# EAGLE design dc_sensor_v2 (EAGLE 6.2)
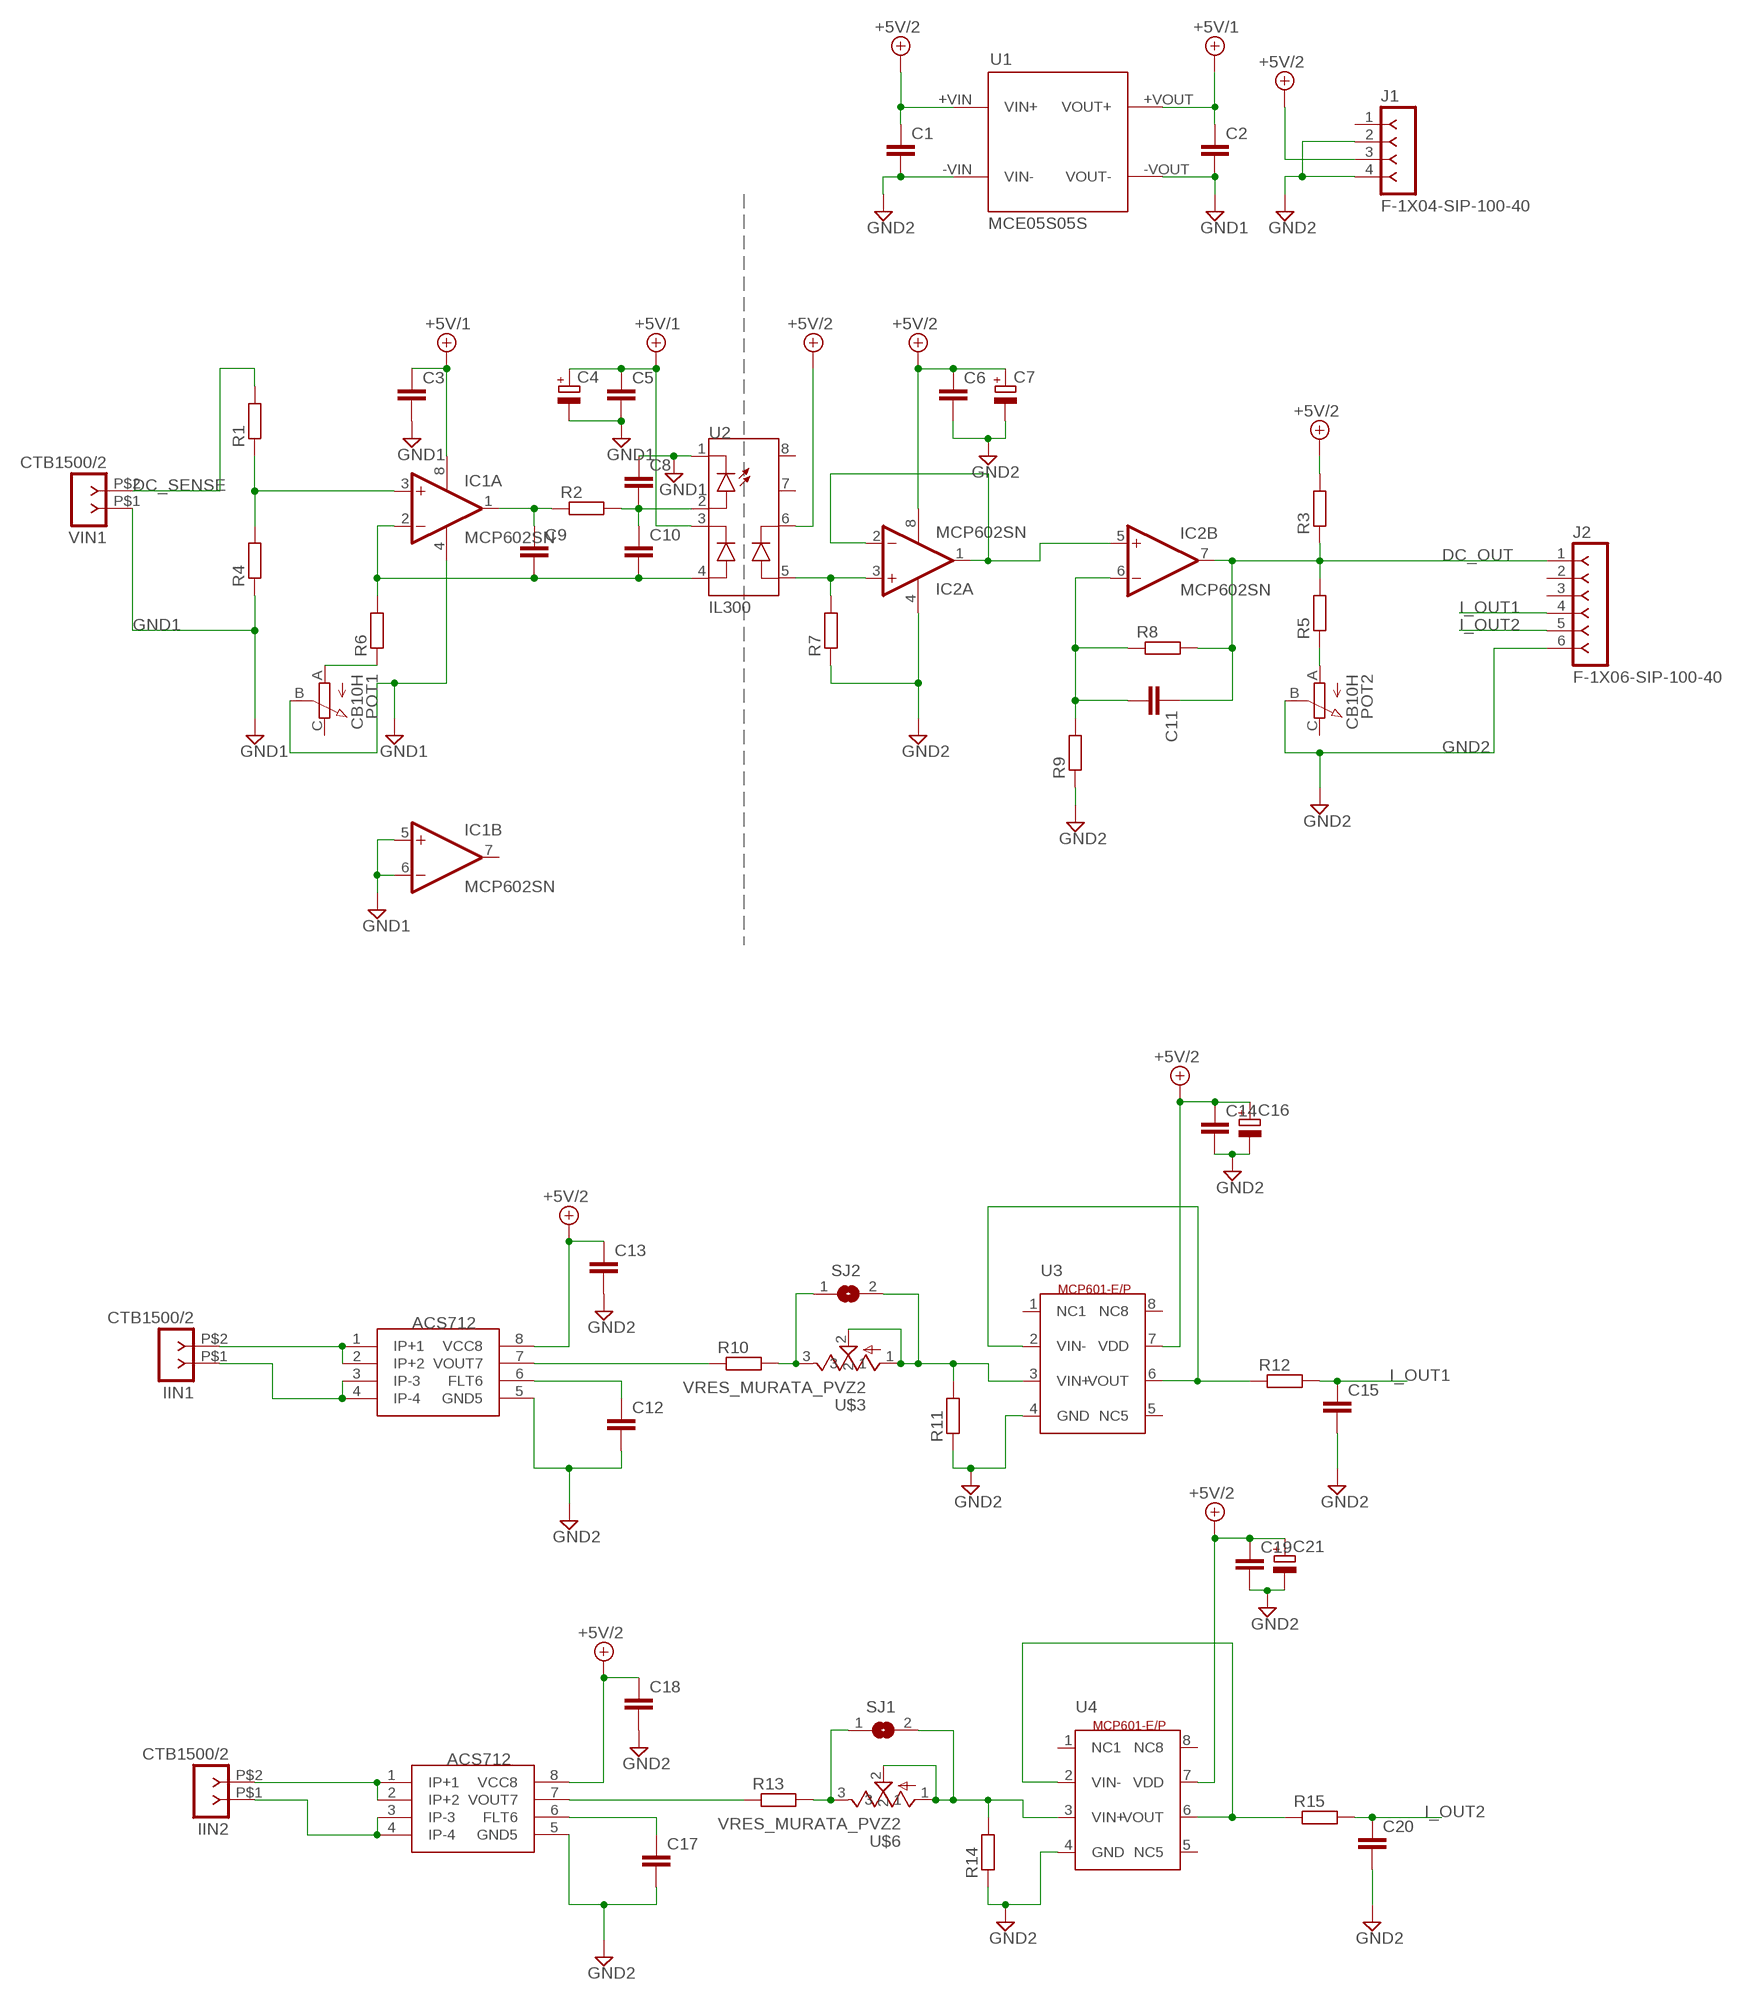
[diagram p0: schematic, sheet 1]

## Parts
C1  C-EUC1206  [C1206]
C2  C-EUC1206  [C1206]
C3  C-EU025-040X050  [C025-040X050]
C4  CPOL-EUE2-5  [E2-5]
C5  C-EU025-040X050  [C025-040X050]
C6  C-EU025-040X050  [C025-040X050]
C7  CPOL-EUE2-5  [E2-5]
C8  C-EU025-040X050  [C025-040X050]
C9  C-EU025-040X050  [C025-040X050]
C10  C-EU025-040X050  [C025-040X050]
C11  C-EU025-040X050  [C025-040X050]
C12  C-EU025-030X050  [C025-030X050]
C13  C-EUC0603  [C0603]
C14  C-EUC0603  [C0603]
C15  C-EU025-030X050  [C025-030X050]
C16  CPOL-EUE2.5-6  [E2,5-6]
C17  C-EU025-030X050  [C025-030X050]
C18  C-EUC0603  [C0603]
C19  C-EUC0603  [C0603]
C20  C-EU025-030X050  [C025-030X050]
C21  CPOL-EUE2.5-6  [E2,5-6]
IC1  MCP602SN  [SO08]
IC2  MCP602SN  [SO08]
IIN1  CTB1500/2  [CTB1500-2]
IIN2  CTB1500/2  [CTB1500-2]
J1  F-1X04-SIP-100-40  [SIP-100-04-40]
J2  F-1X06-SIP-100-40  [SIP-100-06-40]
POT1  CB10H  [CB10V]
POT2  CB10H  [CB10V]
R1  R-EU_0207/10  [0207/10]
R2  R-EU_0207/10  [0207/10]
R3  R-EU_0207/10  [0207/10]
R4  R-EU_0207/10  [0207/10]
R5  R-EU_0207/10  [0207/10]
R6  R-EU_0207/10  [0207/10]
R7  R-EU_0207/10  [0207/10]
R8  R-EU_0207/10  [0207/10]
R9  R-EU_0207/10  [0207/10]
R10  R-EU_0207/10  [0207/10]
R11  R-EU_0207/10  [0207/10]
R12  R-EU_0207/10  [0207/10]
R13  R-EU_0207/10  [0207/10]
R14  R-EU_0207/10  [0207/10]
R15  R-EU_0207/10  [0207/10]
SJ1  SJ  [SJ]
SJ2  SJ  [SJ]
U1  MCE05S05S  [MCEXXSXXS_SIP]
U2  IL300  [DIL08]
U3  MCP601  [SO8]
U4  MCP601  [SO8]
U5  ACS712  [SO8]
U6  ACS712  [SO8]
U$3  VRES_MURATA_PVZ2  [MURATA_PVZ2A]
U$6  VRES_MURATA_PVZ2  [MURATA_PVZ2A]
VIN1  CTB1500/2  [CTB1500-2]

## Nets
+5V/1: C2.1 C3.1 C4.+ C5.1 IC1.8(P:V+) U1.+VOUT(VOUT+) U2.3(C_FB)
+5V/2: C1.1 C6.1 C7.+ C13.1 C14.1 C16.+ C18.1 C19.1 C21.+ IC2.8(P:V+) J1.3 R3.2 U1.+VIN(VIN+) U2.6(C_OUT) U3.7(VDD) U4.7(VDD) U5.8(VCC8) U6.8(VCC8)
DC_OUT: C11.1 IC2.7(B:OUT) J2.1 R3.1 R5.2 R8.2
DC_SENSE: R1.2 VIN1.P$2
GND1: C2.2 C3.2 C4.- C5.2 C8.1 IC1.4(P:V-) IC1.5(B:+IN) IC1.6(B:-IN) POT1.B(S) R4.1 U1.-VOUT(VOUT-) U2.1(C_LED) VIN1.P$1
GND2: C1.2 C6.2 C7.- C12.2 C13.2 C14.2 C15.2 C16.- C17.2 C18.2 C19.2 C20.2 C21.- IC2.4(P:V-) J1.2 J1.4 J2.6 POT2.B(S) R7.1 R9.1 R11.1 R14.1 U1.-VIN(VIN-) U3.4(GND) U4.4(GND) U5.5(GND5) U6.5(GND5)
I_OUT1: C15.1 J2.4 R12.2
I_OUT2: C20.1 J2.5 R15.2
N$1: C9.2 C10.2 IC1.2(A:-IN) R6.2 U2.4(A_FB)
N$2: POT2.A R5.1
N$3: IC2.3(A:+IN) R7.2 U2.5(A_OUT)
N$4: C8.2 C10.1 R2.2 U2.2(A_LED)
N$5: C9.1 IC1.1(A:OUT) R2.1
N$6: IC2.1(A:OUT) IC2.2(A:-IN) IC2.5(B:+IN)
N$7: POT1.A R6.1
N$8: IC1.3(A:+IN) R1.1 R4.2
N$9: IIN1.P$2 U6.1(IP+1) U6.2(IP+2)
N$10: C11.2 IC2.6(B:-IN) R8.1 R9.2
N$11: IIN1.P$1 U6.3(IP-3) U6.4(IP-4)
N$12: R10.2 SJ2.1 U$3.3
N$13: C12.1 U6.6(FLT6)
N$14: R12.1 U3.2(VIN-) U3.6(VOUT)
N$15: IIN2.P$2 U5.1(IP+1) U5.2(IP+2)
N$16: R10.1 U6.7(VOUT7)
N$17: R11.2 SJ2.2 U3.3(VIN+) U$3.1 U$3.2
N$18: IIN2.P$1 U5.3(IP-3) U5.4(IP-4)
N$19: C17.1 U5.6(FLT6)
N$20: R13.1 U5.7(VOUT7)
N$21: R14.2 SJ1.2 U4.3(VIN+) U$6.1 U$6.2
N$22: R13.2 SJ1.1 U$6.3
N$23: R15.1 U4.2(VIN-) U4.6(VOUT)
Unconnected: IC1.7(B:OUT) J1.1 J2.2 J2.3 POT1.C(E) POT2.C(E) U2.7(PIN7) U2.8(PIN8) U3.1(NC1) U3.5(NC5) U3.8(NC8) U4.1(NC1) U4.5(NC5) U4.8(NC8)

## Library data of the parts
C1-C3 C5 C6 C8-C15 C17-C20 = resistor:C-EU: CAPACITOR, European symbol
C4 C7 C16 C21 = resistor:CPOL-EU: POLARIZED CAPACITOR, European symbol
IC1 IC2 = linear:MCP602: Single Op Amp 2.7V to 6.0V Single Supply CMOS Source: http://ww1.microchip.com/downloads/en/DeviceDoc/21314g.pdf
IIN1 IIN2 VIN1 = eko-parts:CTB1500/2
J1 = con-headers-jp:F-1X04-: FEMALE HEADER
J2 = con-headers-jp:F-1X06-: FEMALE HEADER
POT1 POT2 = passive-trimmer:CB10H: http://onecall.farnell.com/jsp/search/browse.jsp;jsessionid=SRTOMW5W3RDHYCQLCIQZOXQ?N=411&Ntk=gensearch&Ntt=CB10*V&Ntx=mode+matchallpartial&exposeLevel2Refinement=true&suggestions=false&ref=globalsearch&_requestid=163591 http://www.tycoelectronics.com/commerce/DocumentDelivery/DDEController?Action=srchrtrv&DocNm=1773190&DocType=Data+Sheet&DocLang=English
R1-R15 = resistor:R-EU_: RESISTOR, European symbol
SJ1 SJ2 = jumper:SJ: SMD solder JUMPER
U1 = modules:MCE05S05S
U2 = ic-optoisolator:IL300
U3 U4 = eko-parts:MCP601
U5 U6 = eko-parts:ACS712
U$3 U$6 = eko-parts:VRES_MURATA_PVZ2: http://www.farnell.com/datasheets/477473.pdf http://onecall.farnell.com/jsp/search/browse.jsp?N=411+202462+110264549+732+502&Ns=P_PRICE_ONECALL_UK|0&locale=en_GB&appliedparametrics=true&getResults=true&suppressRedirect=true&originalQueryURL=/jsp/search/browse.jsp%3FN%3D411%2B202462%26No%3D0%26getResults%3Dtrue%26appliedparametrics%3Dtrue%26locale%3Den_GB%26divisionLocale%3Den_GB%26catalogId%3D%26prevNValues%3D411%2B202462

## Board
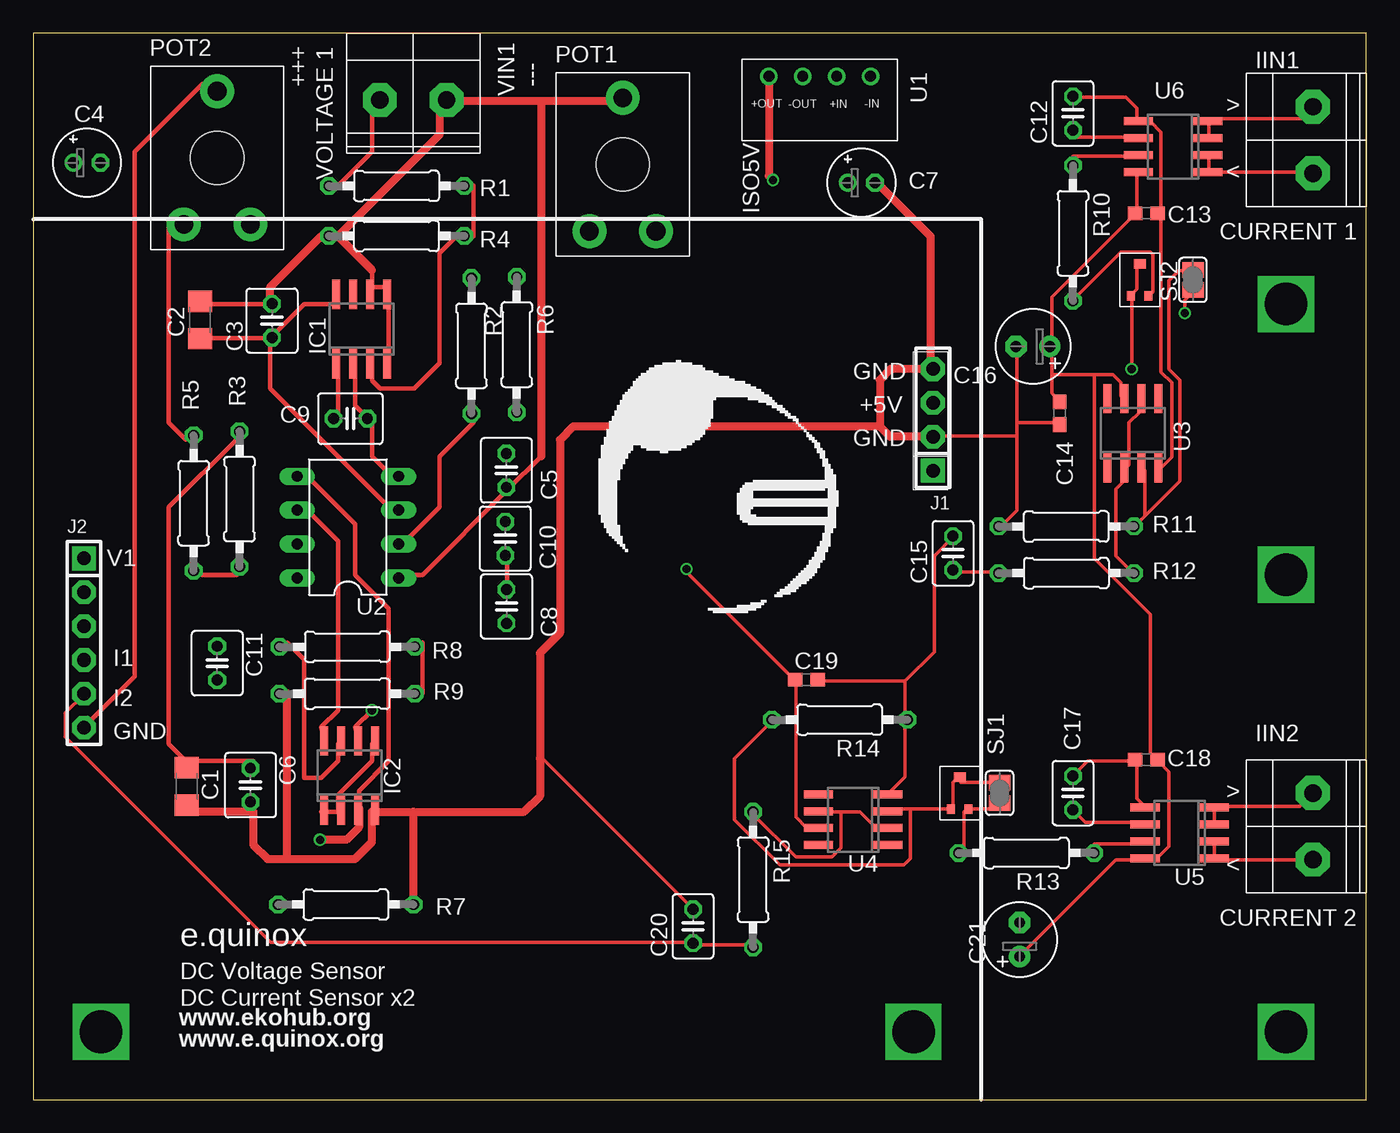
[diagram p1: board, top side]
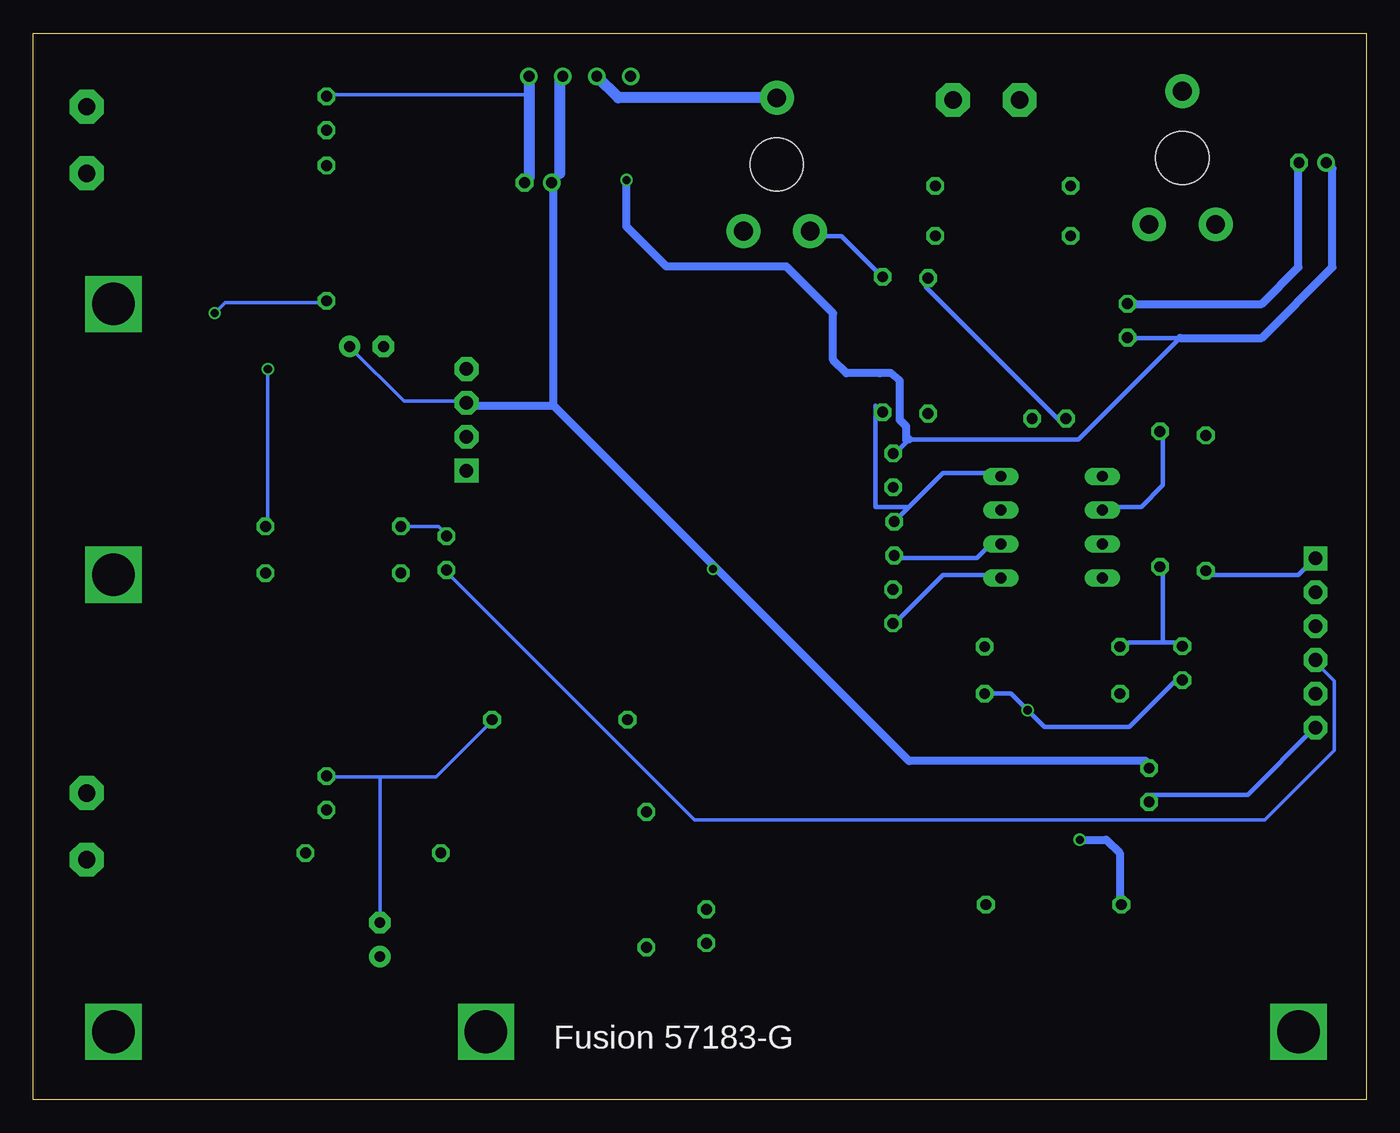
[diagram p2: board, bottom side, seen from below]

Size 100 x 80 mm. Coordinates in mm from the lower left corner, seen from the top.
Outline: 0,0 100,0 100,80 0,80 0,0
Copper layers (1*16): Top 0.035mm / dielectric 1.5mm / Bottom 0.035mm
Design rules: minimum track width 6mil, minimum drill 12mil, track to track 6mil, track to pad 6mil, pad to pad 6mil, via to via 6mil, smd to smd 0mil, copper to edge 10mil, drill to drill 10mil, minimum pad ring 10mil, minimum via ring 6mil, stop-mask expansion 2mil, vias tented up to drill 100mil, thermal gap 10mil

### Footprints (pad centres in the part's own frame; a part is rotated, then mirrored left to right if it is on the bottom)
C1206 = smd 1.6 x 1.8: 1 -1.4,0; 2 1.4,0
C025-040X050 = drill 0.813 octagon: 1 -1.27,0; 2 1.27,0
E2-5 = drill 0.813 pad 1.27: + -1.016,0 | drill 0.813 pad 1.27 octagon: - 1.016,0
C025-030X050 = drill 0.813 octagon: 1 -1.27,0; 2 1.27,0
C0603 = smd 1.1 x 1: 1 -0.85,0; 2 0.85,0
E2,5-6 = drill 0.813 pad 1.6: + -1.27,0 | drill 0.813 pad 1.6 octagon: - 1.27,0
SO08 = smd 0.6 x 2.2: 1 -1.905,-2.6; 2 -0.635,-2.6; 3 0.635,-2.6; 4 1.905,-2.6; 5 1.905,2.6; 6 0.635,2.6; 7 -0.635,2.6; 8 -1.905,2.6
CTB1500-2 = drill 1.3 pad 2.54 octagon: P$1 -2.5,0.5; P$2 2.5,0.5
SIP-100-04-40 = drill 1.016 pad 1.778 square: 1 -3.81,0 | drill 1.016 pad 1.778 octagon: 2 -1.27,0; 3 1.27,0; 4 3.81,0
SIP-100-06-40 = drill 1.016 pad 1.778 square: 1 -6.35,0 | drill 1.016 pad 1.778 octagon: 2 -3.81,0; 3 -1.27,0; 4 1.27,0; 5 3.81,0; 6 6.35,0
CB10V = drill 1.4 pad 2.54: A -2.5,-5; B 0,5; C 2.5,-5 | hole 4: 0,0
0207/10 = drill 0.813 octagon: 1 -5.08,0; 2 5.08,0
SJ = smd 1.168 x 1.6: 1 -0.762,0; 2 0.762,0
MCEXXSXXS_SIP = drill 0.8: +VIN -1.27,-1.778; +VOUT 3.81,-1.778; -VIN -3.81,-1.778; -VOUT 1.27,-1.778
DIL08 = drill 0.813 long: 1 -3.81,-3.81; 2 -1.27,-3.81; 3 1.27,-3.81; 4 3.81,-3.81; 5 3.81,3.81; 6 1.27,3.81; 7 -1.27,3.81; 8 -3.81,3.81
SO8 = smd 0.6 x 2.2: 1 -1.905,-2.6; 2 -0.635,-2.6; 3 0.635,-2.6; 4 1.905,-2.6; 5 1.905,2.6; 6 0.635,2.6; 7 -0.635,2.6; 8 -1.905,2.6
MURATA_PVZ2A = smd 0.6 x 0.7: 1 -0.65,-1.2; 3 0.65,-1.2 | smd 0.9 x 0.7: 2 0,1.2

### Placement (x,y rotation side)
C1  11.5,23.5 270 top
C2  12.5,58.5 90 top
C3  17.91,58.44 90 top
C4  4.02,70.29 0 top
C5  35.49,47.21 270 top
C6  16.29,23.59 270 top
C7  62.13,68.79 0 top
C8  35.5,37 90 top
C9  23.79,51.09 0 top
C10  35.41,42.09 90 top
C11  13.79,32.74 270 top
C12  78,74 90 top
C13  83.5,66.5 0 top
C14  77,51.5 270 top
C15  69,41 90 top
C16  75,56.5 180 top
C17  78,23 90 top
C18  83.5,25.5 180 top
C19  58,31.5 0 top
C20  49.5,13 90 top
C21  74,12 90 top
IC1  24.63,57.81 0 top
IC2  23.74,24.31 0 top
IIN1  95.5,72 270 top
IIN2  95.5,20.5 270 top
J1  67.5,51 90 top
J2  3.8,34.25 270 top
POT1  44.22,70.16 0 top
POT2  13.79,70.66 0 top
R1  27.25,68.55 180 top
R2  32.87,56.55 270 top
R3  15.47,45.05 90 top
R4  27.25,64.8 0 top
R5  12.03,44.75 270 top
R6  36.27,56.65 270 top
R7  23.45,14.63 180 top
R8  23.55,33.97 180 top
R9  23.55,30.45 0 top
R10  78,65 270 top
R11  77.5,43 0 top
R12  77.5,39.5 180 top
R13  74.5,18.5 180 top
R14  60.5,28.5 180 top
R15  54,16.5 270 top
SJ1  72.5,23 90 top
SJ2  87,61.5 90 top
U1  59,75 180 top
U2  23.6,42.95 90 top
U3  82.5,50 0 top
U4  61.5,21 90 top
U5  86,20 90 top
U6  85.5,71.5 90 top
U$1  [EQNXLOGO]  52.5,45 0 top
U$3  83,61.5 0 top
U$6  69.5,23 0 top
VIN1  28.5,75.5 180 top

### Tracks (layer width: path | path; a pad name or v marks a point on that pad's centre or on a via)
+5V/1  (via drill 0.6)
  Top 0.33: 17.78,57.15 12.7,57.15 C2.1 | 17.78,57.15 20.32,59.69 22.86,59.69 IC1.8 | 17.78,57.15 17.78,53.34 26.67,44.45 U2.3 | 17.78,57.15 C3.1
  Top 0.61: U1.+VOUT 55.19,69.31 v55.5,69
  Bottom 0.33: 2.54,69.85 C4.+ | C3.1 17.78,57.15 13.97,57.15 21.59,49.53 34.29,49.53 35.56,48.26 C5.1
  Bottom 0.61: 13.97,57.15 7.83,57.15 2.54,62.44 2.54,69.85 | 34.29,49.53 34.5,49.5 34.5,50.5 35,51 35,53.94 35.64,54.49 36.5,54.5 39,54.5 40,55.5 40,59 43.5,62.5 52.5,62.5 55.5,65.5 v55.5,69
+5V/2  (via drill 0.61)
  Top 0.254: C21.+ 74,10.8 81.2,18 83.4,18 U5.8 83.4,18.2 84.4,18.2 85.2,19 85.2,24.6 84.4,25.4 C18.1 84.2,25.6 83.8,26 83.8,36.4 79.6,40.6 79.6,54.4 | U6.8 82.8,69.4 82.8,66.6 C13.1 82.6,66.4 76.4,60.2 76.4,56.6 C16.+ 76.4,56.4 76.4,54.4 | 76.4,54.4 76.4,53 77,52.4 C14.1 | 76.4,54.4 79.6,54.4 | 79.6,54.4 81,54.4 81.6,53.8 81.6,52.8 81.8,52.6 U3.7 | U4.7 58.8,20.4 58,20.4 57.2,21.2 57.2,31.4 C19.1 57,31.6 49,39.6 v49,39.8
  Top 0.33: 11.43,25.4 16.51,25.4 C6.1 | IC2.8 21.59,27.94 22.86,29.21 22.86,41.91 20.32,44.45 U2.6 | 11.43,25.4 10.16,26.67 10.16,44.45 15.24,49.53 R3.2 | 11.43,25.4 C1.1
  Bottom 0.254: v49,39.8 48.84,39.95 | C16.+ 76.2,56.4 72.2,52.4 67.8,52.4 J1.3
  Bottom 0.33: 60.96,68.58 C7.+ | R3.2 15.24,49.53 15.24,46.09 16.88,44.45 19.05,44.45 U2.6 | 16.51,25.4 C6.1
  Bottom 0.61: 60.96,52.07 60.96,68.58 | 60.96,52.07 67.31,52.07 J1.3 | 60.96,52.07 48.84,39.95 34.29,25.4 16.51,25.4 | 61.11,68.89 60.5,69.5
  Bottom 0.813: C7.+ 61.11,68.89 | 60.5,69.5 60.5,76.55 U1.+VIN
DC_OUT
  Top 0.33: R5.2 12.7,39.37 15.24,39.37 R3.1 | IC2.7 22.86,26.67 22.86,25.4 21.59,24.13 20.32,24.13 20.32,33.02 19.05,34.29 R8.2
  Bottom 0.33: J2.1 3.81,40.64 5.08,39.37 11.43,39.37 R5.2 | 15.24,34.29 17.78,34.29 R8.2 | 15.24,34.29 13.97,34.29 C11.1 | 15.24,34.29 15.24,39.37 R3.1
DC_SENSE
  Top 0.33: R1.2 22.86,68.58 25.4,71.12 25.4,74.93 VIN1.P$2
GND1
  Top 0.33: IC1.4 26.67,55.88 26.67,59.69 IC1.5 26.67,60.96 25.4,60.96 | 25.4,60.96 25.4,62.23 | 25.4,60.96 IC1.6 | C2.2 12.7,59.69 17.78,59.69 C3.2 | 21.59,64.77 R4.1 | 35.56,45.72 29.21,39.37 27.94,39.37 U2.1 | 38.1,48.26 35.56,45.72 | 35.56,45.72 C5.2
  Top 0.61: 25.4,62.23 22.86,64.77 | 21.59,64.77 17.78,60.96 17.78,59.69 | 38.1,74.93 31.75,74.93 VIN1.P$1 30.48,74.93 30.48,72.39 22.86,64.77 | 38.1,74.93 43.18,74.93 POT1.B | 38.1,74.93 38.1,48.26 | 22.86,64.77 R4.1
  Bottom 0.33: 5.08,69.85 C4.- | 17.78,59.69 C3.2 | C8.1 35.56,35.56 31.75,39.37 27.94,39.37 U2.1
  Bottom 0.61: 17.78,59.69 7.83,59.69 5.08,62.44 5.08,69.85
  Bottom 0.813: POT1.B 56.11,75.16 U1.-VOUT
GND2
  Top 0.254: 65.4,31.4 59,31.4 C19.2 | 65.4,31.4 65.4,28.6 R14.1 65.4,28.4 65.4,24.2 64.2,23 U4.4 | C17.2 79.13,25.4 82.6,25.4 C18.2 82.8,25.4 82.8,22.6 83.4,22 U5.5 | 84.6,66.8 84.4,66.6 C13.2 84.6,66.8 | 84.6,66.8 84.6,72.6 83.8,73.4 83,73.4 U6.5 82.8,73.6 82.8,74.38 81.97,75.2 78,75.2 C12.2 | 84.6,66.8 84.6,54.6 85.4,53.8 85.4,48.2 84.6,47.4 U3.4 | C20.2 49.4,14.4 38.2,25.6 38,25.6 | 73.8,50.8 77,50.8 C14.2 | 73.8,50.8 73.8,56.4 C16.- | 73.8,50.8 73.8,49.8 | 73.8,49.8 73.8,44.2 72.6,43 R11.1 | 73.8,49.8 67.8,49.8 J1.2 | 65.4,31.4 67.6,33.6 67.6,40.8 69,42.2 C15.2
  Top 0.33: 11.43,21.59 C1.2 | 19.05,30.48 R9.1 | POT2.B 12.7,76.2 7.62,71.12 7.62,31.75 3.81,27.94 J2.6 | 25.4,21.59 IC2.4
  Top 0.61: C7.- 63.5,68.58 67.31,64.77 67.31,55 J1.4 64.31,54.81 63.5,54 63.5,50.5 | 16.51,21.59 11.43,21.59 | 16.51,21.59 16.51,19.12 17.58,18.05 19.05,18.05 | 19.05,18.05 24.13,18.05 25.4,19.32 25.4,21.59 28.5,21.59 | 16.51,21.59 C6.2 | 19.05,18.05 19.05,30.48 | 28.5,21.59 36.83,21.59 38,22.76 38,25.6 38,33.5 39.5,35 39.5,49.5 40.5,50.5 63.5,50.5 | J1.2 64.27,49.73 63.5,50.5 | R7.1 28.53,21.56 28.5,21.59
  Bottom 0.254: 74,24.2 C21.- | 74,24.2 78,24.2 C17.2 | 74,24.2 69.8,24.2 65.6,28.4 R14.1 | R11.1 69.6,43 69,42.4 C15.2 | 62.81,75.4 78,75.4 C12.2
  Bottom 0.33: J2.6 3.81,27.94 8.89,22.86 16.51,22.86 C6.2
  Bottom 0.61: 62.81,69.13 C7.-
  Bottom 0.813: U1.-VIN 62.81,75.4 62.81,69.13
I_OUT1
  Top 0.254: C15.1 69,39.6 72.4,39.6 R12.2
  Bottom 0.254: J2.4 3.8,32.8 2.4,31.4 2.4,26.2 7.6,21 50.4,21 69,39.6 C15.1
I_OUT2
  Top 0.254: R15.2 54,11.6 49.6,11.6 C20.1 49.4,11.8 17.8,11.8 2.4,27.2 2.4,29 3.8,30.4 J2.5
N$1
  Top 0.33: 25.4,50.8 24.13,52.07 24.13,54.61 IC1.2 | 25.4,50.8 25.4,48.26 26.67,46.99 U2.4 | 25.4,50.8 C9.2
  Bottom 0.33: 34.29,44.45 31.75,46.99 27.94,46.99 U2.4 | 34.29,44.45 35.56,43.18 C10.2 | 34.29,44.45 36.83,44.45 36.83,52.07 R6.2
N$2
  Top 0.33: R5.1 11.43,49.53 10.16,50.8 10.16,66.04 POT2.A
N$3  (via drill 0.6)
  Top 0.33: IC2.3 24.43,21.89 24.43,23.16 26.67,25.4 26.67,36.83 24.13,39.37 24.13,43.18 20.32,46.99 U2.5
  Top 0.61: 24.43,21.89 24.43,20.43 23.5,19.5 v21.5,19.5
  Bottom 0.61: v21.5,19.5 19.5,19.5 18.5,18.5 18.5,14.76 R7.2
N$4
  Top 0.33: C10.1 35.56,40.64 35.56,38.1 C8.2 | R2.2 33.02,50.8 30.48,48.26 30.48,44.45 27.94,41.91 U2.2
  Bottom 0.33: U2.2 27.94,41.91 29.21,40.64 35.56,40.64 C10.1
N$5
  Top 0.33: IC1.1 22.86,54.61 22.86,50.8 C9.1
  Bottom 0.33: R2.1 33.02,60.96 22.86,50.8 C9.1
N$6
  Top 0.33: 22.86,21.59 21.59,21.59 IC2.1 | 22.86,21.59 22.86,22.86 25.4,25.4 25.4,26.67 IC2.5 | 22.86,21.59 IC2.2
N$7
  Bottom 0.33: R6.1 36.83,62.23 39.37,64.77 40.64,64.77 POT1.A
N$8
  Top 0.33: IC1.3 25.4,54.61 25.4,53.96 26.02,53.34 28.55,53.34 30.48,55.27 30.48,63.5 31.75,64.77 R4.2 33.02,64.77 33.02,68.58 R1.1
N$9
  Top 0.254: 88.2,69.6 88.2,70.8 U6.2 | 88.2,69.6 96,69.6 IIN1.P$2 | 88.2,69.6 U6.1
N$10  (via drill 0.61)
  Top 0.33: v25.4,29.21 24.13,27.94 IC2.6 | R8.1 29.21,34.29 29.21,30.48 R9.2
  Bottom 0.33: R9.2 27.94,30.48 26.67,30.48 v25.4,29.21 24.13,27.94 17.78,27.94 13.97,31.75 C11.2
N$11
  Top 0.254: U6.3 88.2,72.2 88.2,73.4 U6.4 88.2,73.6 95.36,73.6 96,74.24 IIN1.P$1
N$12  (via drill 0.61)
  Top 0.254: U$3.3 83.8,60.4 84,60.6 84,63.4 83.8,63.6 81.6,63.6 80.6,62.6 78,60 R10.2 | v86.4,59 86.4,60 87,60.6 SJ2.1
  Bottom 0.254: v86.4,59 85.6,59.8 78,59.8 R10.2
N$13
  Top 0.254: C12.1 78,72.2 82.8,72.2 U6.6
N$14
  Top 0.254: U3.6 83,52.6 83,51.6 82.2,50.8 82.2,47.6 82,47.4 U3.2 81.8,47.4 81.8,46.4 81.2,45.8 81.2,40.8 82.4,39.6 R12.1
N$15
  Top 0.254: U5.2 U5.1 88.6,18 IIN2.P$2
N$16
  Top 0.254: R10.1 78,70.8 82.8,70.8 U6.7
N$17  (via drill 0.61)
  Top 0.254: U$3.2 83,62.6 82.8,62.4 82.8,60.8 82.4,60.4 U$3.1 82.4,60.2 v82.4,54.8 | 83.4,43.8 82.6,43 R11.2 | 83.4,43.8 86,46.4 86,54 85.2,54.8 85.2,61.44 85.96,62.2 87,62.2 SJ2.2 | 83.4,43.8 83.4,47.2 83.2,47.4 U3.3
  Bottom 0.254: v82.4,54.8 82.4,43 R11.2
N$18
  Top 0.254: U5.3 U5.4 88.6,22 95,22 IIN2.P$1
N$19
  Top 0.254: C17.1 78.93,20.8 83.4,20.8 U5.6
N$20
  Top 0.254: U5.7 83.4,19.2 79.6,19.2 79.6,18.6 R13.1
N$21
  Top 0.254: 65.8,21.8 64.2,21.8 U4.3 | 65.8,21.8 U$6.1 69,21.8 69,23.8 69.4,24.2 U$6.2 69.6,24.2 69.6,23.8 72.4,23.8 SJ1.2 | 65.8,21.8 65.8,18.1 65.3,17.6 56,17.6 52.6,21 52.6,25.6 55.4,28.4 R14.2
N$22
  Top 0.254: SJ1.1 72.4,22.2 72.4,21.8 U$6.3 70,21.8 69.8,21.6 69.8,18.8 69.6,18.6 R13.2
N$23
  Top 0.254: 60.6,21.6 62,21.6 62.4,21.2 63.2,20.4 64,20.4 U4.2 | 60.6,21.6 59,21.6 U4.6 | 60.6,21.6 60.6,18.87 59.93,18.2 57.2,18.2 54,21.4 R15.1
N$24  (via drill 3.2)
  other vias: 5.08,5.08
N$25  (via drill 3.2)
  other vias: 66.04,5.08
N$26  (via drill 3.2)
  other vias: 93.98,5.08
N$27  (via drill 3.2)
  other vias: 93.98,39.37
N$28  (via drill 3.2)
  other vias: 93.98,59.69

### Text on the board
tPlace: +++ | --- | > | VOLTAGE 1 | < | ISO5V | CURRENT 1 | GND | +5V | GND | V1 | I1 | I2 | GND | > | < | CURRENT 2 | e.quinox | DC Voltage Sensor | DC Current Sensor x2 | www.ekohub.org | www.e.quinox.org
bPlace: Fusion 57183-G